# Altium project MPU6050 (GY521).PrjPcb
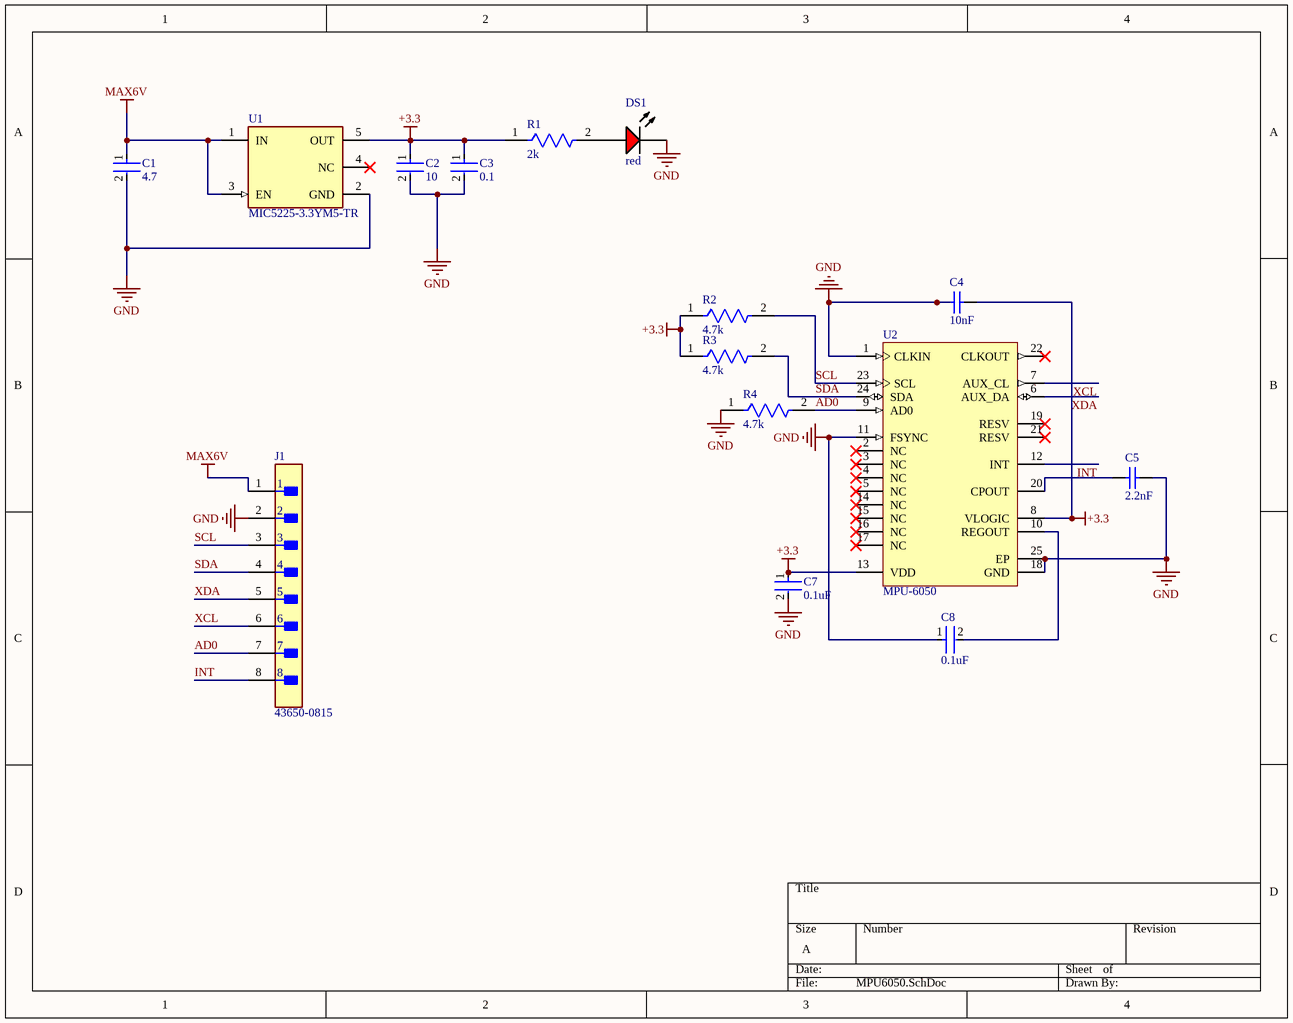
[diagram p0: MPU6050.SchDoc]
1 sheet, 15 parts. Net scope: global (net labels, ports and power ports of the same name join across sheets).
Board file: MPU6050.PcbDoc

## Sheet MPU6050.SchDoc
size A; SheetNumber: 1; SheetTotal: 1

### Parts
C1  4.7  [FP-C0805C475K8PACTU-MFG]
C2  10  [FP-GRM21B-0_15-IPC_C]
C3  0.1  [FP-GCM155-0_05-IPC_C]
C4  10nF  [CAPC0402(1005)60_M]
C5  2.2nF  [CAPC1608X90X35NL10T15]
C7  0.1uF  [FP-GCM155-0_05-IPC_C]
C8  0.1uF  [FP-GCM155-0_05-IPC_C]
DS1  red  [VISH-TLMX1100_V]
J1  43650-0815  [FP-43650-0815-MFG]
R1  2k  [FP-AC0603-IPC_B]
R2  4.7k  [FP-CRCW0805-e3-IPC_B]
R3  4.7k  [FP-CRCW0805-e3-IPC_B]
R4  4.7k  [FP-CRCW0805-e3-IPC_B]
U1  MIC5225-3.3YM5-TR  [FP-SOT23-5LD-PL-1-MFG]
U2  MPU-6050  [IS-QFN-24_V]

### Nets
+3.3: C2.1 C3.1 C4.1 C7.1 R1.1 R2.1 R3.1 U1.5(OUT) U2.8(VLOGIC) U2.13(VDD)
GND: C1.2 C2.2 C3.2 C4.2 C5.2 C7.2 C8.1 DS1.2(K) J1.2 R4.1 U1.2(GND) U2.1(CLKIN) U2.11(FSYNC) U2.18(GND) U2.25(EP)
MAX6V: C1.1 J1.1 U1.1(IN) U1.3(EN)
AD0: J1.7 R4.2 U2.9(AD0)
INT: J1.8 U2.12(INT)
SCL: J1.3 R2.2 U2.23(SCL)
SDA: J1.4 R3.2 U2.24(SDA)
XCL: J1.6 U2.7(AUX_CL)
XDA: J1.5 U2.6(AUX_DA)
NetC5_1: C5.1 U2.20(CPOUT)
NetC8_2: C8.2 U2.10(REGOUT)
NetDS1_1: DS1.1(A) R1.2

Not connected (* = marked no-connect by the designer): U1 4(NC)*; U2 2(NC)* 3(NC)* 4(NC)* 5(NC)* 14(NC)* 15(NC)* 16(NC)* 17(NC)* 19(RESV)* 21(RESV)* 22(CLKOUT)*

### Library data of the parts
C1 = CMP-2007-01007-2: CAP CER 4.7UF 10V X5R 0805; Dielectric Material: Ceramic; Dissipation Factor: 5%; Tolerance: 10%; Lead Pitch: 0.75mm; Mount: Surface Mount; Voltage Rating (DC): 10V; Length: 2mm; Case Code (Imperial): 0805; Height: 1.25mm; Package Quantity: 1; Thickness: 0.055inch; Depth: 1.25mm; Case Code (Metric): 2012; Termination: SMD/SMT; Construction: Flat; Dielectric: X5R; Series: C; Capacitance: 4.7uF; Width: 1.2mm; Max Operating Temperature: 85°C; Packaging: Tape and Reel; Voltage Rating: 10V; REACH SVHC: No SVHC; Min Operating Temperature: -55°C; Number of Pins: 2; Case/Package: 0805; Radiation Hardening: No; Lead Free: Lead Free; Voltage: 10V; RoHS Compliant: Yes
C2 = CMP-2007-03541-2: Chip Multilayer Ceramic Capacitors for General Purpose, 0805, 10uF, X5R, 15%, 10%, 25V; Length: 2mm; Depth: 1.25mm; Termination: SMD/SMT; Voltage: 25V; Height: 1.25mm; Material: Ceramic; Thickness: 0.053inch; Radiation Hardening: No; Min Operating Temperature: -55°C; Width: 0.049inch; Package Quantity: 1; Mount: Surface Mount; Dielectric: X5R; Packaging: Tape and Reel; Capacitance: 10uF; Voltage Rating (DC): 25V; Lead Free: Lead Free; Max Operating Temperature: 85°C; Case Code (Imperial): 0805; Case/Package: 0805; Tolerance: 10%; Voltage Rating: 25V; Case Code (Metric): 2012
C3 C7 C8 = CMP-2008-03711-3: Ceramic Capacitor for Automotive 100nF ±10% 16VDC X7R 0402 Paper T/R; Voltage Rating (DC): 16V; Termination: SMD/SMT; Length: 1mm; Voltage: 16V; Mount: Surface Mount; Packaging: Tape and Reel; Case Code (Metric): 1005; Case/Package: 0402; Voltage Rating: 16V; Min Operating Temperature: -55°C; Case Code (Imperial): 0402; Ratings: AEC-Q200; Height: 0.5mm; Tolerance: 10%; Width: 0.02inch; Radiation Hardening: No; Depth: 0.5mm; Capacitance: 100nF; Max Operating Temperature: 125°C; Package Quantity: 1; REACH SVHC: No SVHC; Thickness: 0.022inch; Dielectric: X7R; Lead Free: Lead Free
C4 = CMP-1034-01878-1: CAP 10nF 16V -20% to +80% 0402 (1005 Metric) Thickness 0.6mm SMD; Case-Metric: 1005; Case-EIA: 0402; Rated Voltage: 16 V; Max Thickness: 0.6 mm; Tolerance: -20% to +80%; Value: 10nF; Technology: SMT
C5 = CMP-2006-02908-5: Chip Capacitor, 2.2 nF, +/- 10%, 50 V, -55 to 125 degC, 0603 (1608 Metric), RoHS, Tape and Reel; Manufacturer: Murata; Voltage Rating: 50 V; Pins: 2; Mount: Surface Mount; Max Operating Temperature: 125 degC; ComponentLink1Description: Manufacturer URL; RoHSCompliant: true; PackageDescription: 2-Pin Surface Mount Device, Body 1.6 x 0.8 mm; ComponentLink2URL: http://search.murata.co.jp/Ceramy/image/img/A01X/G101/ENG/GRM188R71H222KA01-01.pdf; PackageReference: 0603; Height: 0.8 mm; Lead Pitch: 4 mm; Packaging: Tape and Reel; DatasheetVersion: 02/2016; Mounting Technology: Surface Mount; ComponentLink2Description: Datasheet; Min Operating Temperature: -55 degC; Length: 1.6 mm; REACH SVHC: No SVHC; Package Quantity: 4000; ComponentLink1URL: http://www.murata.com/
DS1 = CMP-1666-00027-1: LED, RED, 2.1 V, -40 to 100 degC, 2-Pin SMD (0603), RoHS, Tape and Reel; Type (Capacitors): C0G; Resistance: 100000000000 Ohm; Capacitance: 12 pF; Voltage Rating: 50 V; Tolerance: 5%; Min Operating Temperature: -55degC; REACH SVHC: No SVHC; ComponentLink2Description: Datasheet; ComponentLink1URL: http://www.vishay.com/; Width: 0.8 mm; Package Quantity: 4000; PackageReference: TLMX1100; ComponentLink2URL: http://www.vishay.com/docs/83173/tlmb1100.pdf; Case/Package: 0603; Case Code (Metric): 1608; Packaging: Tape and Reel; Pins: 2; ComponentLink1Description: Manufacturer URL; Max Operating Temperature: 125degC; Height: 0.8 mm; Length: 1.6 mm; Mount: Surface Mount; PackageDescription: 2-Pin Surface Mount Device, Body 1.6 x 0.8 mm; DatasheetVersion: Rev. 2.7, 03/2016; Case Code (Imperial): 0603; Voltage Rating (DC): 50 V; RoHSCompliant: True; Radiation Hardening: No
J1 = CMP-00257-00277531-1: 43650-0815 Conn Wire to Board HDR 8 POS 3mm Solder ST Top Entry Thru-Hole Micro-Fit 3.0™ Tray; NexarPartId: 277531; Manufacturer Lifecycle Status: ACTIVE; Contact Resistance: 30mΩ; Insulation Resistance: 1GΩ; Number of Circuits: 8; Connector Type: Plug, Socket; Number of Ports: 1; Glow Wire Compliant: Compliant; Voltage Rating: 600V; Gender: Male; Max Voltage Rating (DC): 250.25kV; Voltage Rating (DC): 250V; Current Rating: 5A; Plating: Tin; Orientation: Vertical, Right Angle; Mount: Through Hole; Length: 27.65mm; REACH SVHC: Unknown; Lead Pitch: 3mm; Min Operating Temperature: -40°C; Country of Origin: US; Housing Color: Black; Halogen Free: Low Halogen; Lead Free: Lead Free; Radiation Hardening: No; Number of Rows: 1; Schedule B: 8536694040; Max Operating Temperature: 105°C; Lifecycle Status: Production; RoHS: Compliant; Color: Black; Contact Material: Brass; Number of Terminals: 8; Number of Positions: 8; Termination: Through Hole; Housing Material: Thermoplastic; Contact Plating: Tin; Number of Contacts: 8; Pitch: 3mm; Flammability Rating: UL94 V-0; Max Voltage Rating (AC): 250V; Depth: 5.57mm
R1 = CMP-2000-04836-2: RES 2kΩ 1.00% 0.1W 0603; Resistance: 2kR; Voltage Rating: 50V; Max Power Dissipation: 100mW; Temperature Coefficient: 100ppm/°C; Tolerance: 1%; Height: 0.45mm; Case Code (Imperial): 0603; Number of Terminations: 2; Termination: SMD/SMT; Max Operating Temperature: 155°C; Min Operating Temperature: -55°C; Features: Moisture Resistant; Size Code: 0603; Military Standard: Not; Depth: 0.8mm; Lead Free: Lead Free; Ratings: AEC-Q200; Case Code (Metric): 1608; Power Rating: 100mW; Resistor Type: Thick Film; Length: 1.6mm; Case/Package: 0603; Packaging: Tape and Reel; Width: 0.8mm; Construction: Rectangular; Series: AC
R2-R4 = CMP-2100-03615-2: RES Thick Film, 4.7kΩ, 1%, 0.125W, 100ppm/°C, 0805; Max Power Dissipation: 125mW; Resistance: 4.7kR; Voltage Rating: 150V; Termination: SMD/SMT; Weight: 0.000194oz; Case/Package: 0805; Number of Terminations: 2; Min Operating Temperature: -55°C; Case Code (Metric): 2012; Package Quantity: 10; Depth: 1.25mm; Military Standard: Not; Composition: Thick Film; Radiation Hardening: No; Contact Plating: Tin; Height: 0.45mm; Power Rating: 125mW; Features: Automotive AEC-Q200; Tolerance: 1%; Packaging: Tape and Reel; Max Operating Temperature: 155°C; Length: 2mm; Case Code (Imperial): 0805; Voltage Rating (DC): 150V; Width: 1.25mm; Temperature Coefficient: 100ppm/°C; Lead Free: Lead Free
U1 = CMP-06324-000013-1: IC REG LINEAR 3.3V 150MA SOT23-5; Manufacturer: Microchip Technology; Max Supply Voltage: 16V; Output Type: Fixed; Accuracy Percentage: 1%; Number Of Outputs: 1; Standoff Height: 0mm; Min Supply Voltage: 2.3V; Dropout Voltage: 310mV; Max Junction Temp: +125°C; Nominal Supply Current: 29-3000uA; Output Current: 150mA; Height: 1.45mm; Device Class L3: Voltage Regulators - Linear; Temperature Range High: +125°C; Temperature Range Low: -40°C; Device Class L2: Power Management ICs; Device Class L1: Integrated Circuits (ICs); Manufacturer Part Number: MIC5225-3.3YM5-TR; Output Voltage: 3.3V; ComponentLink2Description: Datasheet; Package: SOT23-5LD-PL-1; ComponentLink2URL: http://ww1.microchip.com/downloads/en/DeviceDoc/mic5225.pdf; Mouser Description: LDO Voltage Regulators High Vin, Low Iq Regulator (Lead Free); RoHS: TRUE; Automotive: No; Temperature: -40°C to +125°C; Category: IC; Octopart: https://octopart.com/mic5225-3.3ym5-tr-microchip-66802280; Lead Free: Yes; Digikey Description: IC REG LINEAR 3.3V 150MA SOT23-5
U2 = CMP-1753-00002-2: 3-Axis Gyroscope, Accelerometer and a Digital Motion Processor(TM) (DMP), 2.375 to 3.46 V, -40 to 85 degC, 24-Pin QFN, RoHS, Tape and Reel; Manufacturer: InvenSense; Featured Product: MPU-60506-Axis,IntegratedI²CSolution; Other Names: 1428-1007-2 / MPU6050; Sensor Type: MotionTracking; Online Catalog: MPU-6000™Series; Unit PriceUSD: Digital; Datasheet Version: Rev. 3.3, 05/2012; Category: Sensors,Transducers; Datasheet URL: http://datasheet.octopart.com/MPU-6050-InvenSense-datasheet-14421344.pdf; Family: Multifunction; Standard Package: 5,000; Manufacturer URL: http://www.invensense.com/; Output Type: Digital; Dynamic Catalog: MPU-6000™Series